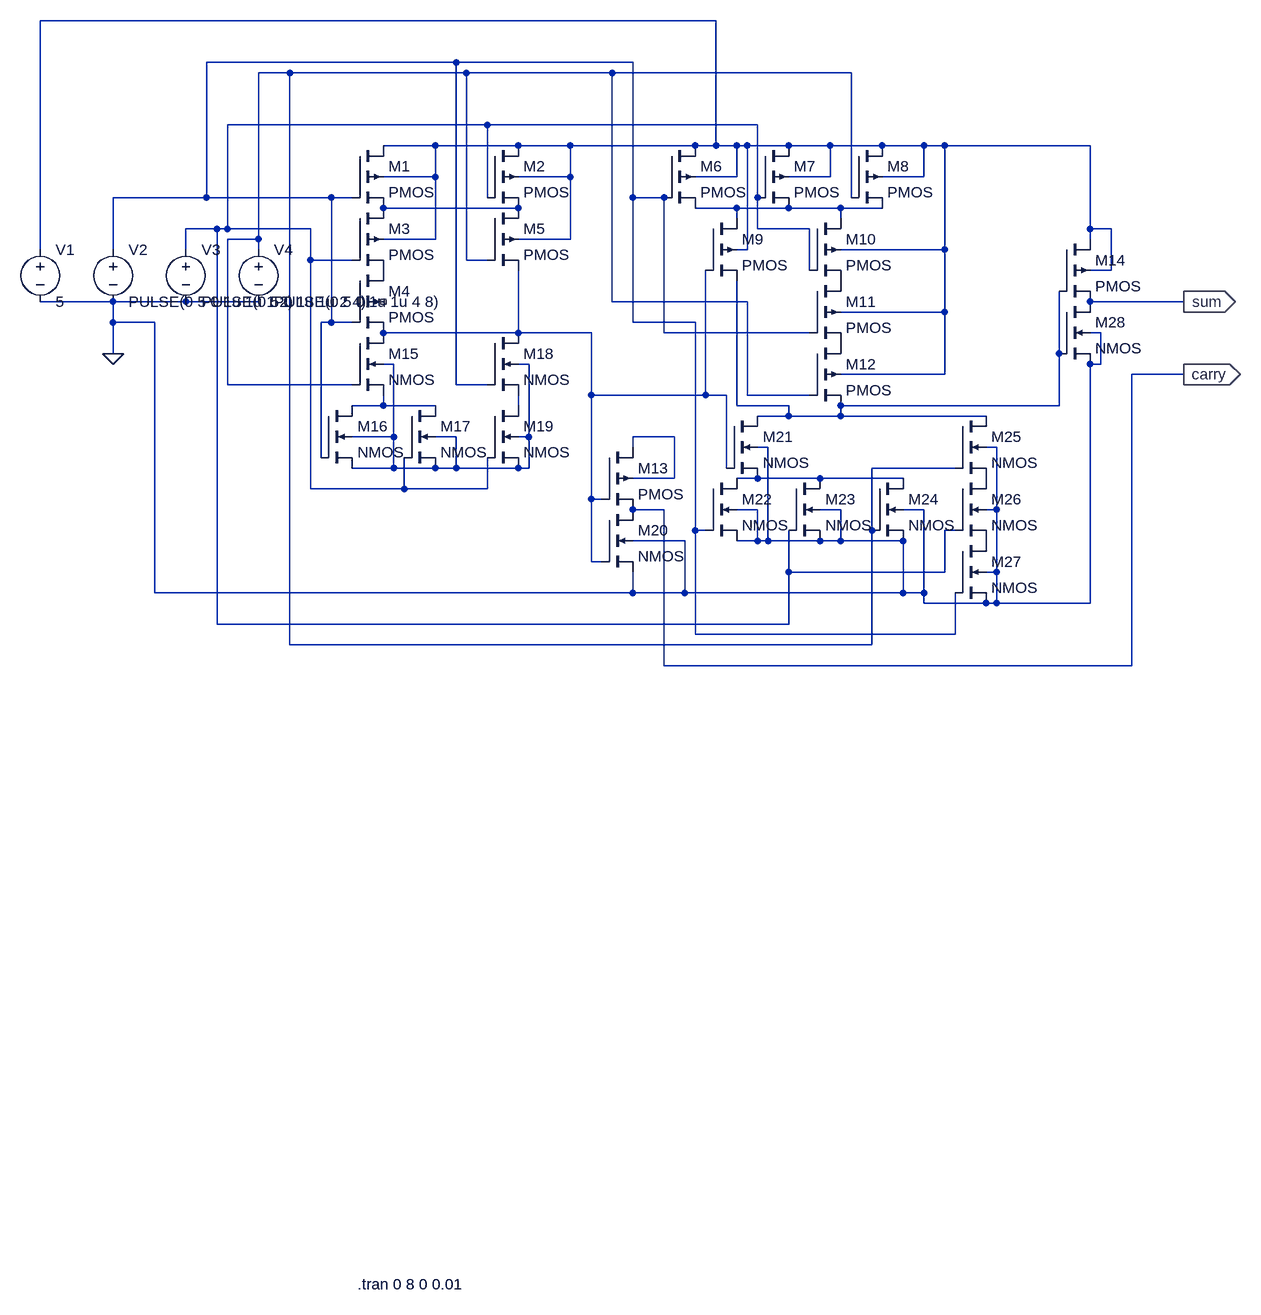
[diagram p0: schematic aoi_fa.asc]
aoi_fa.asc, the LTspice schematic file:
Version 4
SHEET 1 2324 2776
WIRE -80 816 -1120 816
WIRE -480 880 -864 880
WIRE -208 880 -480 880
WIRE -736 896 -784 896
WIRE -464 896 -736 896
WIRE -240 896 -464 896
WIRE 128 896 -240 896
WIRE -432 976 -832 976
WIRE -16 976 -432 976
WIRE -512 1008 -592 1008
WIRE -384 1008 -512 1008
WIRE -304 1008 -384 1008
WIRE -112 1008 -304 1008
WIRE -80 1008 -80 816
WIRE -80 1008 -112 1008
WIRE -48 1008 -80 1008
WIRE -32 1008 -48 1008
WIRE 32 1008 -32 1008
WIRE 96 1008 32 1008
WIRE 176 1008 96 1008
WIRE 240 1008 176 1008
WIRE 272 1008 240 1008
WIRE 496 1008 272 1008
WIRE -512 1056 -512 1008
WIRE -512 1056 -592 1056
WIRE -304 1056 -304 1008
WIRE -304 1056 -384 1056
WIRE -48 1056 -48 1008
WIRE -48 1056 -112 1056
WIRE 96 1056 96 1008
WIRE 96 1056 32 1056
WIRE 240 1056 240 1008
WIRE 240 1056 176 1056
WIRE -864 1088 -864 880
WIRE -864 1088 -1008 1088
WIRE -672 1088 -864 1088
WIRE -640 1088 -672 1088
WIRE -432 1088 -432 976
WIRE -208 1088 -208 880
WIRE -160 1088 -208 1088
WIRE -16 1088 -16 976
WIRE 128 1088 128 896
WIRE -384 1104 -592 1104
WIRE -48 1104 -112 1104
WIRE 32 1104 -48 1104
WIRE 112 1104 32 1104
WIRE 176 1104 112 1104
WIRE -48 1120 -48 1104
WIRE 112 1120 112 1104
WIRE -848 1136 -896 1136
WIRE -832 1136 -832 976
WIRE -832 1136 -848 1136
WIRE -704 1136 -832 1136
WIRE -16 1136 -16 1088
WIRE 64 1136 -16 1136
WIRE 496 1136 496 1008
WIRE 528 1136 496 1136
WIRE -784 1152 -784 896
WIRE -784 1152 -832 1152
WIRE -512 1152 -512 1056
WIRE -512 1152 -592 1152
WIRE -304 1152 -304 1056
WIRE -304 1152 -384 1152
WIRE 496 1152 496 1136
WIRE -1120 1168 -1120 816
WIRE -1008 1168 -1008 1088
WIRE -896 1168 -896 1136
WIRE -784 1168 -784 1152
WIRE -32 1168 -32 1008
WIRE -32 1168 -48 1168
WIRE 272 1168 272 1008
WIRE 272 1168 112 1168
WIRE -704 1184 -704 1136
WIRE -640 1184 -704 1184
WIRE -464 1184 -464 896
WIRE -432 1184 -464 1184
WIRE 64 1200 64 1136
WIRE 528 1200 528 1136
WIRE 528 1200 496 1200
WIRE -1008 1248 -1120 1248
WIRE -896 1248 -1008 1248
WIRE -784 1248 -896 1248
WIRE -240 1248 -240 896
WIRE -32 1248 -240 1248
WIRE 640 1248 496 1248
WIRE 272 1264 272 1168
WIRE 272 1264 112 1264
WIRE -1008 1280 -1008 1248
WIRE -944 1280 -1008 1280
WIRE -672 1280 -672 1088
WIRE -672 1280 -688 1280
WIRE -640 1280 -672 1280
WIRE -208 1280 -208 1088
WIRE -112 1280 -208 1280
WIRE -384 1296 -384 1200
WIRE -384 1296 -592 1296
WIRE -272 1296 -384 1296
WIRE -160 1296 -160 1088
WIRE 64 1296 -160 1296
WIRE 512 1296 496 1296
WIRE -1008 1328 -1008 1280
WIRE 448 1328 448 1232
WIRE -576 1344 -592 1344
WIRE -368 1344 -384 1344
WIRE 512 1344 512 1296
WIRE 512 1344 496 1344
WIRE 272 1360 272 1264
WIRE 272 1360 112 1360
WIRE 640 1360 560 1360
WIRE -832 1376 -832 1152
WIRE -640 1376 -832 1376
WIRE -480 1376 -480 880
WIRE -432 1376 -480 1376
WIRE -272 1392 -272 1296
WIRE -96 1392 -96 1200
WIRE -96 1392 -272 1392
WIRE -64 1392 -96 1392
WIRE -32 1392 -32 1248
WIRE 64 1392 -32 1392
WIRE -592 1408 -592 1392
WIRE -592 1408 -640 1408
WIRE -512 1408 -592 1408
WIRE -384 1408 -384 1392
WIRE -48 1408 -48 1216
WIRE 32 1408 -48 1408
WIRE 448 1408 448 1328
WIRE 448 1408 112 1408
WIRE 32 1424 32 1408
WIRE 32 1424 -16 1424
WIRE 112 1424 112 1408
WIRE 112 1424 32 1424
WIRE 336 1424 112 1424
WIRE -576 1456 -576 1344
WIRE -576 1456 -640 1456
WIRE -480 1456 -512 1456
WIRE -368 1456 -368 1344
WIRE -368 1456 -384 1456
WIRE -144 1456 -208 1456
WIRE -208 1472 -208 1456
WIRE 0 1472 -16 1472
WIRE 352 1472 336 1472
WIRE -688 1488 -688 1280
WIRE -576 1504 -576 1456
WIRE -576 1504 -640 1504
WIRE -512 1504 -576 1504
WIRE -480 1504 -480 1456
WIRE -480 1504 -512 1504
WIRE -384 1504 -480 1504
WIRE -368 1504 -368 1456
WIRE -368 1504 -384 1504
WIRE -64 1504 -64 1392
WIRE 288 1504 160 1504
WIRE -144 1520 -144 1456
WIRE -144 1520 -208 1520
WIRE -16 1520 -48 1520
WIRE 80 1520 -16 1520
WIRE 208 1520 80 1520
WIRE -704 1536 -704 1184
WIRE -560 1536 -560 1488
WIRE -560 1536 -704 1536
WIRE -432 1536 -432 1488
WIRE -432 1536 -560 1536
WIRE -272 1552 -272 1392
WIRE -256 1552 -272 1552
WIRE -160 1568 -208 1568
WIRE -16 1568 -48 1568
WIRE 112 1568 80 1568
WIRE 240 1568 208 1568
WIRE 352 1568 352 1472
WIRE 352 1568 336 1568
WIRE -112 1600 -112 1280
WIRE -96 1600 -112 1600
WIRE 160 1600 160 1504
WIRE 288 1600 272 1600
WIRE -128 1616 -208 1616
WIRE -16 1616 -16 1568
WIRE -16 1616 -48 1616
WIRE 0 1616 0 1472
WIRE 0 1616 -16 1616
WIRE 80 1616 0 1616
WIRE 112 1616 112 1568
WIRE 112 1616 80 1616
WIRE 208 1616 112 1616
WIRE -272 1648 -272 1552
WIRE -256 1648 -272 1648
WIRE 32 1664 32 1600
WIRE 272 1664 272 1600
WIRE 272 1664 32 1664
WIRE 352 1664 352 1568
WIRE 352 1664 336 1664
WIRE -944 1696 -944 1280
WIRE -208 1696 -208 1664
WIRE -208 1696 -944 1696
WIRE -128 1696 -128 1616
WIRE -128 1696 -208 1696
WIRE 208 1696 208 1616
WIRE 208 1696 -128 1696
WIRE 240 1696 240 1568
WIRE 240 1696 208 1696
WIRE 240 1712 240 1696
WIRE 336 1712 240 1712
WIRE 352 1712 352 1664
WIRE 352 1712 336 1712
WIRE 496 1712 496 1344
WIRE 496 1712 352 1712
WIRE -848 1744 -848 1136
WIRE 32 1744 32 1664
WIRE 32 1744 -848 1744
WIRE -112 1760 -112 1600
WIRE 288 1760 288 1696
WIRE 288 1760 -112 1760
WIRE -736 1776 -736 896
WIRE 160 1776 160 1600
WIRE 160 1776 -736 1776
WIRE -160 1808 -160 1568
WIRE 560 1808 560 1360
WIRE 560 1808 -160 1808
FLAG -1008 1328 0
FLAG 640 1248 sum
IOPIN 640 1248 Out
FLAG 640 1360 carry
IOPIN 640 1360 Out
SYMBOL voltage -1120 1152 R0
WINDOW 123 0 0 Left 0
WINDOW 39 0 0 Left 0
SYMATTR InstName V1
SYMATTR Value 5
SYMBOL voltage -1008 1152 R0
WINDOW 123 0 0 Left 0
WINDOW 39 0 0 Left 0
SYMATTR InstName V2
SYMATTR Value PULSE(0 5 0 1u 1u 1 2)
SYMBOL voltage -896 1152 R0
WINDOW 123 0 0 Left 0
WINDOW 39 0 0 Left 0
SYMATTR InstName V3
SYMATTR Value PULSE(0 5 0 1u 1u 2 4)
SYMBOL voltage -784 1152 R0
WINDOW 123 0 0 Left 0
WINDOW 39 0 0 Left 0
SYMATTR InstName V4
SYMATTR Value PULSE(0 5 0 1u 1u 4 8)
SYMBOL pmos4 -640 1008 R0
SYMATTR InstName M1
SYMBOL pmos4 -432 1008 R0
SYMATTR InstName M2
SYMBOL pmos4 -640 1104 R0
SYMATTR InstName M3
SYMBOL pmos4 -640 1200 R0
SYMATTR InstName M4
SYMBOL pmos4 -432 1104 R0
SYMATTR InstName M5
SYMBOL pmos4 -160 1008 R0
SYMATTR InstName M6
SYMBOL pmos4 -16 1008 R0
SYMATTR InstName M7
SYMBOL pmos4 128 1008 R0
SYMATTR InstName M8
SYMBOL pmos4 -96 1120 R0
SYMATTR InstName M9
SYMBOL pmos4 64 1120 R0
SYMATTR InstName M10
SYMBOL pmos4 64 1216 R0
SYMATTR InstName M11
SYMBOL pmos4 64 1312 R0
SYMATTR InstName M12
SYMBOL pmos4 -256 1472 R0
SYMATTR InstName M13
SYMBOL pmos4 448 1152 R0
SYMATTR InstName M14
SYMBOL nmos4 -640 1296 R0
SYMATTR InstName M15
SYMBOL nmos4 -688 1408 R0
SYMATTR InstName M16
SYMBOL nmos4 -560 1408 R0
SYMATTR InstName M17
SYMBOL nmos4 -432 1296 R0
SYMATTR InstName M18
SYMBOL nmos4 -432 1408 R0
SYMATTR InstName M19
SYMBOL nmos4 -256 1568 R0
SYMATTR InstName M20
SYMBOL nmos4 -64 1424 R0
SYMATTR InstName M21
SYMBOL nmos4 -96 1520 R0
SYMATTR InstName M22
SYMBOL nmos4 32 1520 R0
SYMATTR InstName M23
SYMBOL nmos4 160 1520 R0
SYMATTR InstName M24
SYMBOL nmos4 288 1424 R0
SYMATTR InstName M25
SYMBOL nmos4 288 1520 R0
SYMATTR InstName M26
SYMBOL nmos4 288 1616 R0
SYMATTR InstName M27
SYMBOL nmos4 448 1248 R0
SYMATTR InstName M28
TEXT -632 2760 Left 2 !.tran 0 8 0 0.01

The netlist it stands for:
* aoi_fa.asc
V1 N001 0 5
V2 N002 0 PULSE(0 5 0 1u 1u 1 2)
V3 N004 0 PULSE(0 5 0 1u 1u 2 4)
V4 N003 0 PULSE(0 5 0 1u 1u 4 8)
M1 N001 N002 N005 N001 PMOS
M2 N001 N004 N005 N001 PMOS
M3 N005 N004 P001 N001 PMOS
M4 P001 N002 N007 NC_01 PMOS
M5 N005 N003 N007 N001 PMOS
M6 N001 N002 N006 N001 PMOS
M7 N001 N004 N006 N001 PMOS
M8 N001 N003 N006 N001 PMOS
M9 N006 N007 N008 N001 PMOS
M10 N006 N004 P002 N001 PMOS
M11 P002 N002 P003 N001 PMOS
M12 P003 N003 N008 N001 PMOS
M13 N012 N007 carry N012 PMOS
M14 N001 N008 sum N001 PMOS
M15 N007 N003 N010 N009 NMOS
M16 N010 N002 N009 N009 NMOS
M17 N010 N004 N009 N009 NMOS
M18 N007 N002 N011 N009 NMOS
M19 N011 N004 N009 N009 NMOS
M20 carry N007 0 0 NMOS
M21 N008 N007 N013 0 NMOS
M22 N013 N002 0 0 NMOS
M23 N013 N004 0 0 NMOS
M24 N013 N003 0 0 NMOS
M25 N008 N003 P004 0 NMOS
M26 P004 N004 P005 0 NMOS
M27 P005 N002 0 0 NMOS
M28 sum N008 0 0 NMOS
.model NMOS NMOS
.model PMOS PMOS
.lib standard.mos
.tran 0 8 0 0.01
.backanno
.end